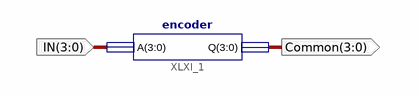
[diagram p0: schematic sheet 1]
// Xilinx ISE schematic main.sch (spartan6) as structural Verilog: 1 symbols, 2 ports
module main (
  input  [3:0] IN,
  output [3:0] Common
);

  encoder XLXI_1 (.A(IN), .Q(Common));
endmodule
